# Altium schematic sheet Fuente_Conn.SchDoc
size Letter
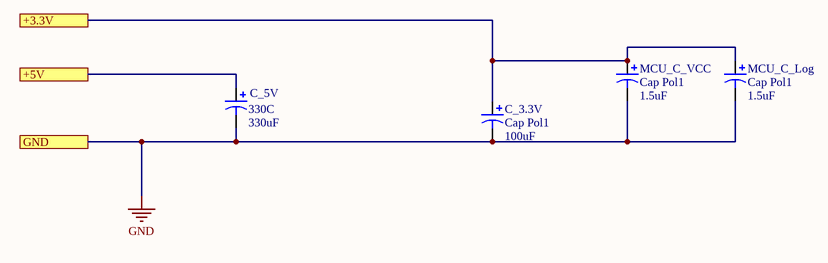
[diagram p0: Fuente_Conn.SchDoc]

## Parts
C_3.3V  Cap Pol1  value 100uF  [Capacitor S Panasonic]
C_5V  330C  value 330uF  [PANASONIC_C]
MCU_C_Log  Cap Pol1  value 1.5uF  [6-0805_L]
MCU_C_VCC  Cap Pol1  value 1.5uF  [6-0805_L]

## Ports
+3.3V, +5V, GND

## Nets
GND: C_3.3V.2 C_5V.2 MCU_C_Log.2 MCU_C_VCC.2 ; port GND
+3.3V: C_3.3V.1 MCU_C_Log.1 MCU_C_VCC.1 ; port +3.3V
+5V: C_5V.1 ; port +5V

## Library data of the parts
C_3.3V C_5V MCU_C_Log MCU_C_VCC = Cap Pol1: Polarized Capacitor (Radial); Published: 8-Jun-2000; LatestRevisionDate: 17-Jul-2002; LatestRevisionNote: Re-released for DXP Platform.; PackageReference: RB7.6-15; Publisher: Altium Limited; PackageDescription: Polarized Capacitor (Radial); 2 Leads